# EAGLE schematic circuitdraft (EAGLE 9.5.1)
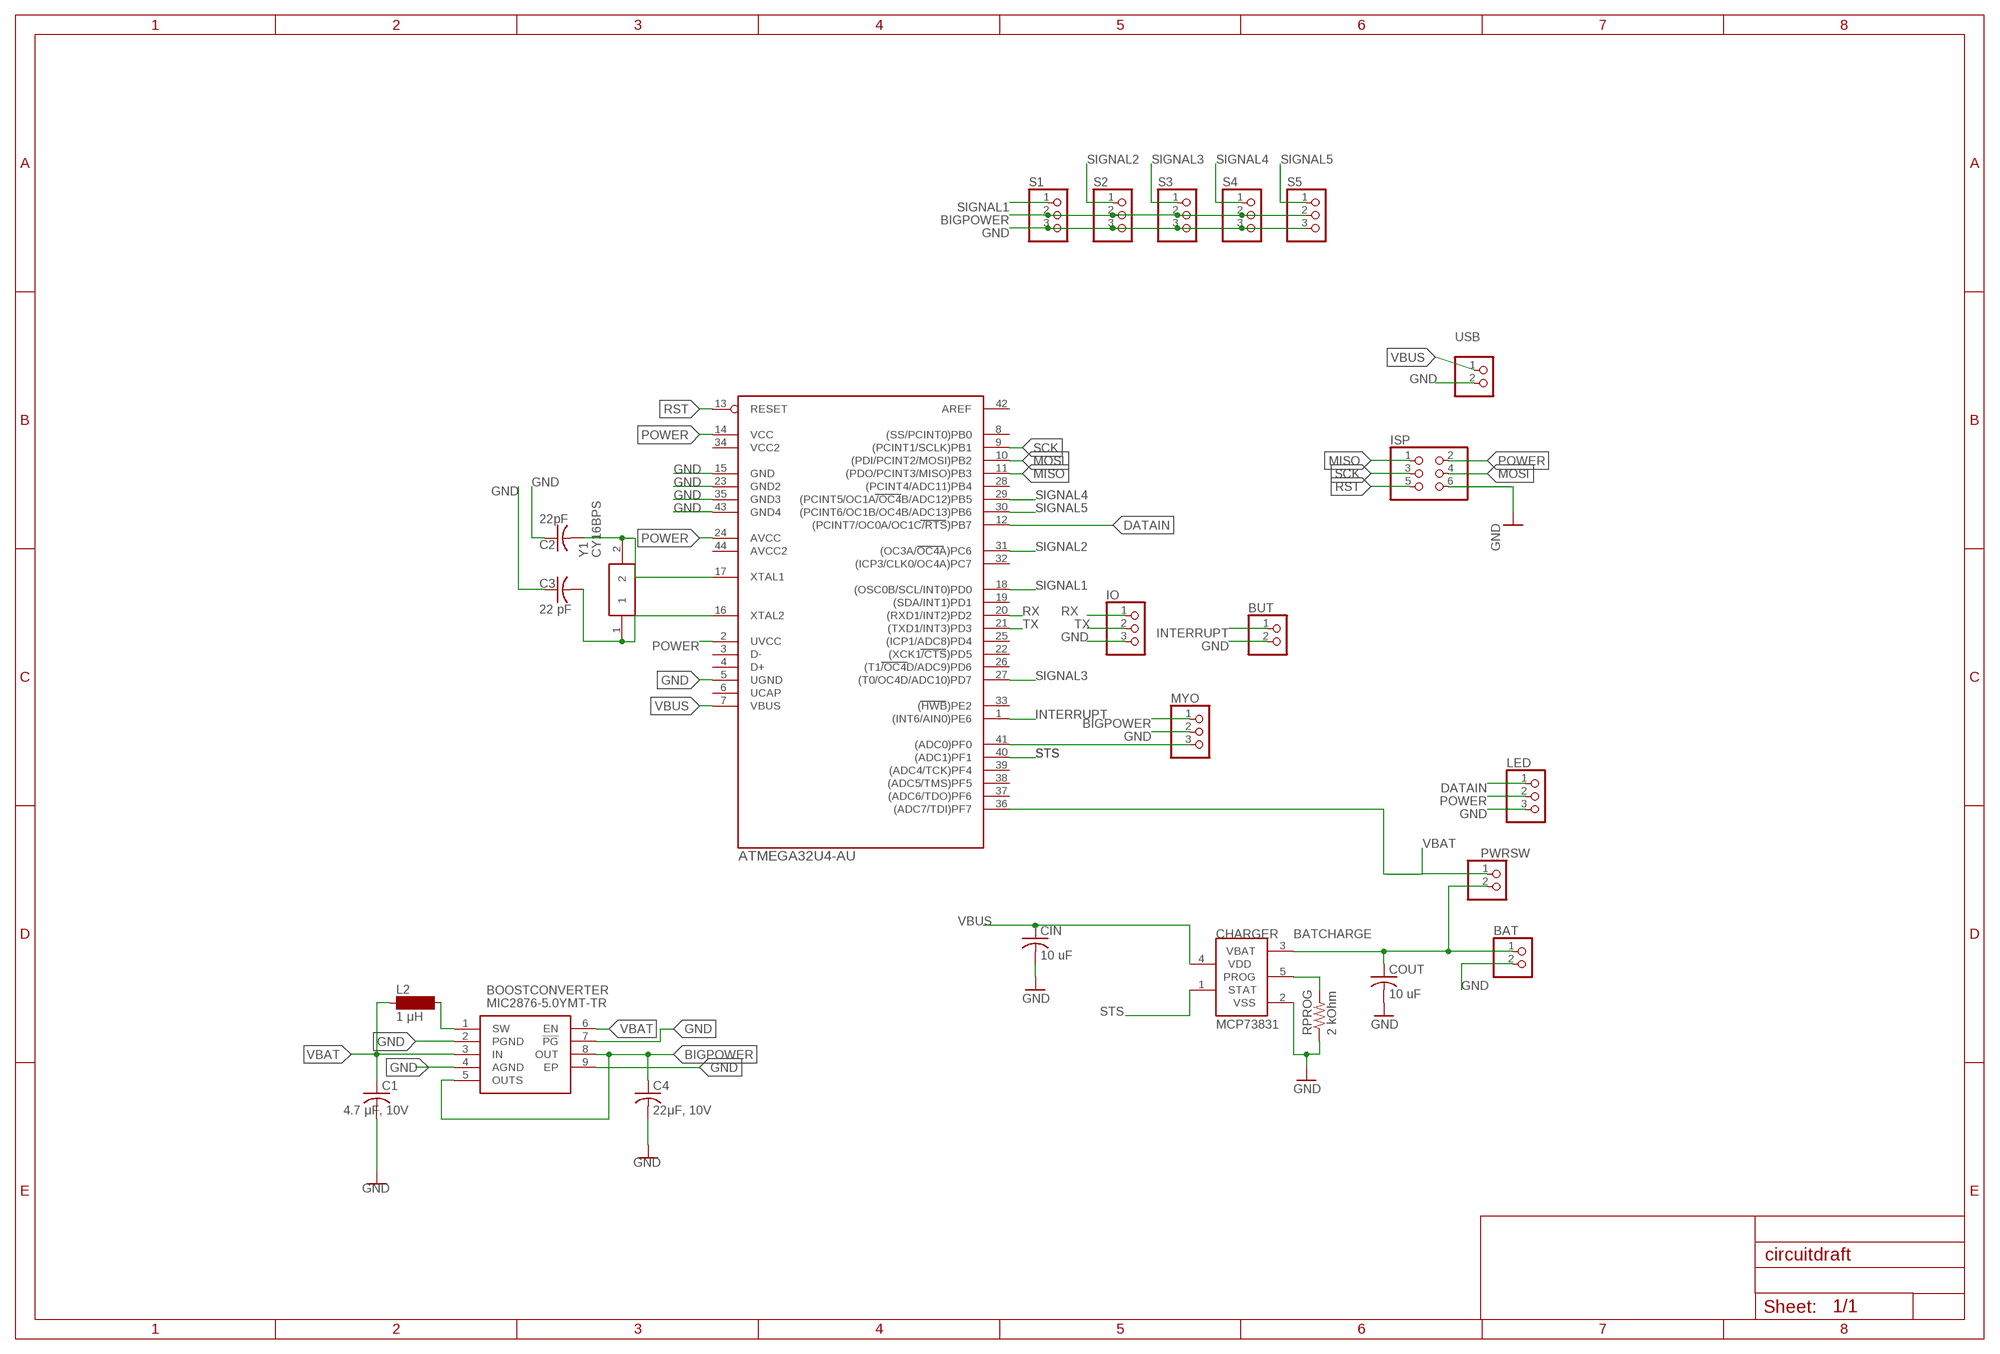
[diagram p0: schematic, sheet 1]

## Parts
BAT  PINHD-1X2  [1X02]
BOOSTCONVERTER  MIC2876-5.0YMT-TR  [MIC287650YMTTR]
BUT  PINHD-1X2  [1X02]
C1  4.7 μF, 10V  C-USC0603  [C0603]
C2  22pF  C-US025-024X044  [C025-024X044]
C3  22 pF  C-US025-024X044  [C025-024X044]
C4  22μF, 10V  C-USC0603  [C0603]
CHARGER  MCP73831  [SOT23-5L]
CIN  10 uF  C-USC0603  [C0603]
COUT  10 uF  C-USC0603  [C0603]
IO  PINHD-1X3  [1X03]
ISP  PINHD-2X3  [2X03]
L2  1 μH  SD75  [SD75]
LED  PINHD-1X3  [1X03]
MYO  PINHD-1X3  [1X03]
PWRSW  PINHD-1X2  [1X02]
RPROG  2 kOhm  R-US_R0603  [R0603]
S1  PINHD-1X3  [1X03]
S2  PINHD-1X3  [1X03]
S3  PINHD-1X3  [1X03]
S4  PINHD-1X3  [1X03]
S5  PINHD-1X3  [1X03]
U$1  ATMEGA32U4-AU  [TQFP44]
USB  PINHD-1X2  [1X02]
Y1  CY16BPS  [CY16BPS]

## Nets
BATCHARGE [power]: BAT.1 CHARGER.3(VBAT) COUT.1 PWRSW.2
BIGPOWER [power]: BOOSTCONVERTER.5(OUTS) BOOSTCONVERTER.8(OUT) C4.1 MYO.1 S1.2 S2.2 S3.2 S4.2 S5.2
DATAIN: LED.1 U$1.12((PCINT7/OC0A/OC1C/RTS)PB7)
GND: BAT.2 BOOSTCONVERTER.2(PGND) BOOSTCONVERTER.4(AGND) BOOSTCONVERTER.7(!PG) BOOSTCONVERTER.9(EP) BUT.2 C1.2 C2.1 C3.1 C4.2 CHARGER.2(VSS) CIN.2 COUT.2 IO.3 ISP.6 LED.3 MYO.2 RPROG.1 S1.3 S2.3 S3.3 S4.3 S5.3 U$1.5(UGND) U$1.15(GND) U$1.23(GND2) U$1.35(GND3) U$1.43(GND4) USB.2
INTERRUPT: BUT.1 U$1.1((INT6/AIN0)PE6)
MISO: ISP.1 U$1.11((PDO/PCINT3/MISO)PB3)
MOSI: ISP.4 U$1.10((PDI/PCINT2/MOSI)PB2)
N$1: MYO.3 U$1.41((ADC0)PF0)
N$3: BOOSTCONVERTER.1(SW) L2.2
N$4: CHARGER.5(PROG) RPROG.2
N$5: C2.2 U$1.17(XTAL1) Y1.2
N$6: C3.2 U$1.16(XTAL2) Y1.1
POWER: ISP.2 LED.2 U$1.2(UVCC) U$1.14(VCC) U$1.24(AVCC)
RST: ISP.5 U$1.13(RESET)
RX: IO.1 U$1.20((RXD1/INT2)PD2)
SCK: ISP.3 U$1.9((PCINT1/SCLK)PB1)
SIGNAL1: S1.1 U$1.18((OSC0B/SCL/INT0)PD0)
SIGNAL2: S2.1 U$1.31((OC3A/OC4A)PC6)
SIGNAL3: S3.1 U$1.27((T0/OC4D/ADC10)PD7)
SIGNAL4: S4.1 U$1.29((PCINT5/OC1A/OC4B/ADC12)PB5)
SIGNAL5: S5.1 U$1.30((PCINT6/OC1B/OC4B/ADC13)PB6)
STS: CHARGER.1(STAT) U$1.40((ADC1)PF1)
TX: IO.2 U$1.21((TXD1/INT3)PD3)
VBAT [power]: BOOSTCONVERTER.3(IN) BOOSTCONVERTER.6(EN) C1.1 L2.1 PWRSW.1 U$1.36((ADC7/TDI)PF7)
VBUS: CHARGER.4(VDD) CIN.1 U$1.7(VBUS) USB.1
Unconnected: U$1.3(D-) U$1.4(D+) U$1.6(UCAP) U$1.8((SS/PCINT0)PB0) U$1.19((SDA/INT1)PD1) U$1.22((XCK1/CTS)PD5) U$1.25((ICP1/ADC8)PD4) U$1.26((T1/OC4D/ADC9)PD6) U$1.28((PCINT4/ADC11)PB4) U$1.32((ICP3/CLK0/OC4A)PC7) U$1.33((HWB)PE2) U$1.34(VCC2) U$1.37((ADC6/TDO)PF6) U$1.38((ADC5/TMS)PF5) U$1.39((ADC4/TCK)PF4) U$1.42(AREF) U$1.44(AVCC2)

## Library data of the parts
BAT BUT PWRSW USB = pinhead:PINHD-1X2: PIN HEADER
BOOSTCONVERTER = 3DPC:MIC2876-5.0YMT-TR: Switching Voltage Regulators Source: Datasheet <https://componentsearchengine.com/Datasheets/1/MIC2876-5.0YMT-TR.pdf>; DESCRIPTION: Switching Voltage Regulators; HEIGHT: 0.6mm; MANUFACTURER_NAME: Microchip; MANUFACTURER_PART_NUMBER: MIC2876-5.0YMT-TR; MOUSER_PART_NUMBER: 998-MIC2876-50YMTTR; MOUSER_PRICE-STOCK: https://www.mouser.com/Search/Refine.aspx?Keyword=998-MIC2876-50YMTTR
C1 C4 CIN COUT = 3DPC:C-US: CAPACITOR, American symbol; SPICEPREFIX: C
C2 C3 = rcl:C-US: CAPACITOR, American symbol; SPICEPREFIX: C
CHARGER = 3DPC:MCP73831: Miniature Single-Cell, Fully Integrated Li-Ion, Li-Polymer Charge Management Controllers
IO LED MYO S1-S5 = pinhead:PINHD-1X3: PIN HEADER
ISP = pinhead:PINHD-2X3: PIN HEADER
L2 = inductor-neosid:SD75: INDUCTOR nominal inductance, E12; OC_FARNELL: unknown; OC_NEWARK: unknown
RPROG = 3DPC:R-US_: RESISTOR, American symbol; SPICEPREFIX: R
U$1 = mega32U4:ATMEGA32U4-AU
Y1 = SamacSys_Parts:CY16BPS: Crystals 16MHz 20pF 0C +70C Source: Datasheet <https://componentsearchengine.com/Datasheets/1/CY16BPS.pdf>; DESCRIPTION: Crystals 16MHz 20pF 0C +70C; HEIGHT: 5mm; MANUFACTURER_NAME: Crystek; MANUFACTURER_PART_NUMBER: CY16BPS; MOUSER_PART_NUMBER: 549-CY16BPS; MOUSER_PRICE-STOCK: https://www.mouser.com/Search/Refine.aspx?Keyword=549-CY16BPS

## Net classes
1 power: width 0.1 mm